# Altium schematic sheet Slave_Schematic_2.SchDoc
size A4; SheetNumber: 2; SheetTotal: 2
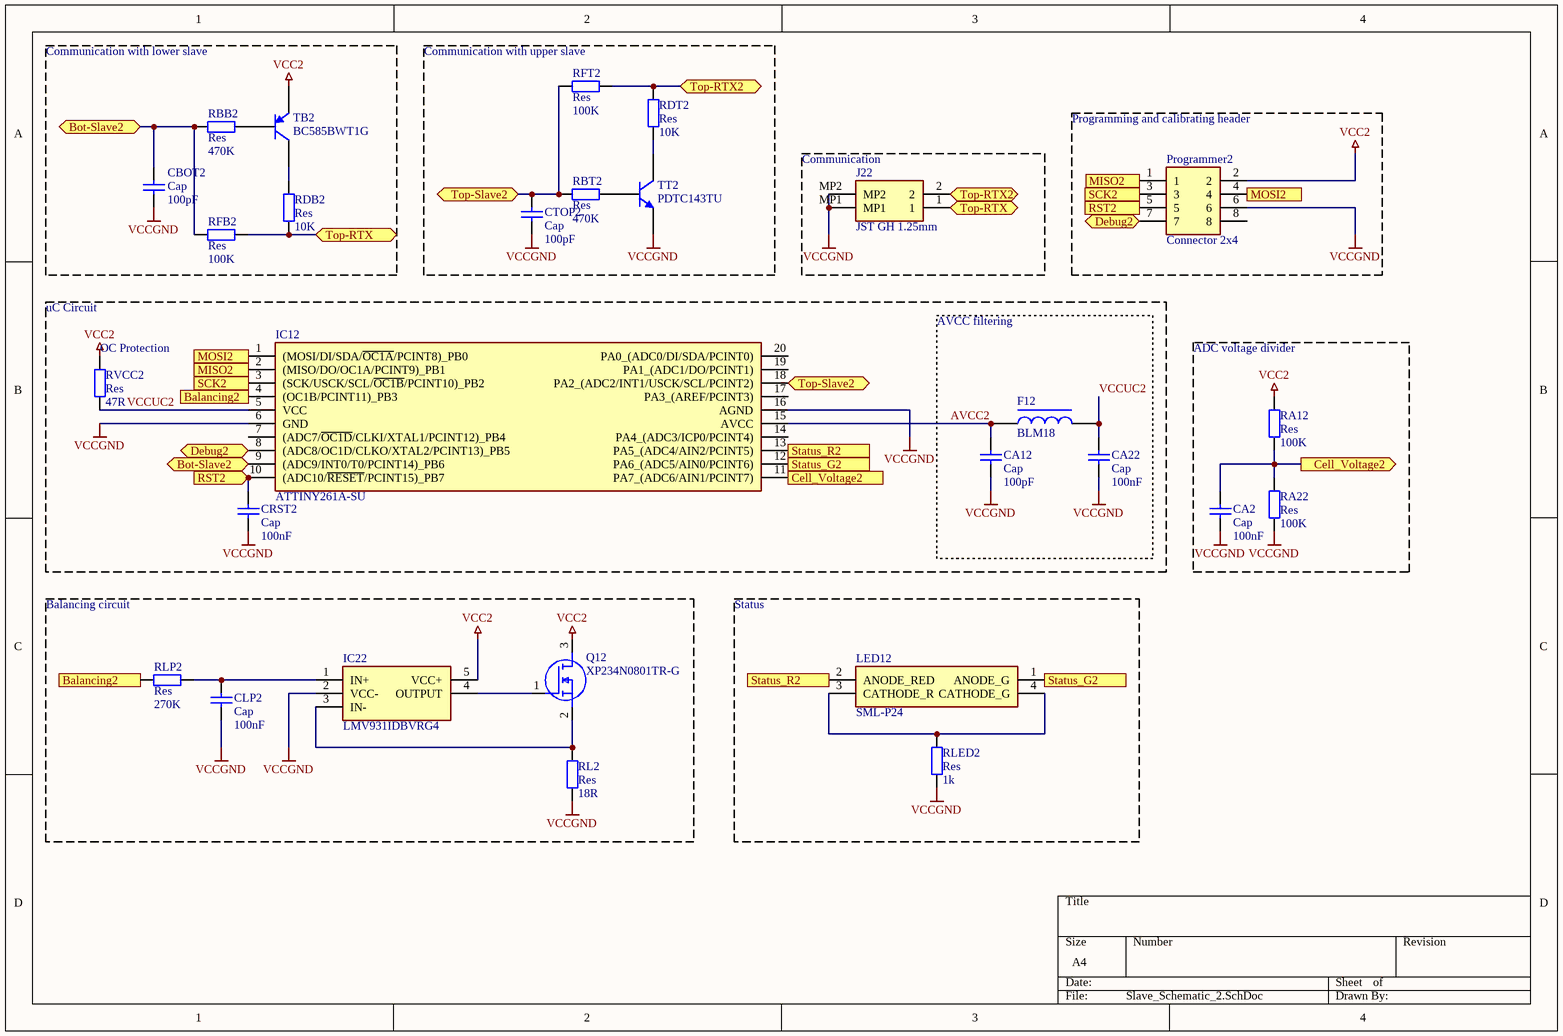
[diagram p0: Slave_Schematic_2.SchDoc]

## Parts
CA2  Cap  value 100nF  [0603]
CA12  Cap  value 100pF  [0603]
CA22  Cap  value 100nF  [0603]
CBOT2  Cap  value 100pF  [0603]
CLP2  Cap  value 100nF  [0603]
CRST2  Cap  value 100nF  [0603]
CTOP2  Cap  value 100pF  [0603]
F12  BLM18  [0603 - BLM18AG102BH1D]
IC12  ATTINY261A-SU  [TSSOP-20T (MO-153 AC)]
IC22  LMV931IDBVRG4  [TSSOP-5N]
J22  JST GH 1.25mm  [BM02BGHHDBTBTLFSN]
LED12  SML-P24  [1010 LED]
Programmer2  Connector 2x4  [Pads 2X4]
Q12  XP234N0801TR-G  [SOT-23 (TO-236)]
RA12  Res  value 100K  [0603]
RA22  Res  value 100K  [0603]
RBB2  Res  value 470K  [0603]
RBT2  Res  value 470K  [0603]
RDB2  Res  value 10K  [0603]
RDT2  Res  value 10K  [0603]
RFB2  Res  value 100K  [0603]
RFT2  Res  value 100K  [0603]
RL2  Res  value 18R  [1020 (Reversed)]
RLED2  Res  value 1k  [0603]
RLP2  Res  value 270K  [0603]
RVCC2  Res  value 47R  [0603]
TB2  BC585BWT1G  [SOT-323 (SC-70)]
TT2  PDTC143TU  [SOT-323 (SC-70)]

## Blocks framed on the sheet
Communication with lower slave: CBOT2 RBB2 RDB2 RFB2 TB2
Communication with upper slave: CTOP2 RBT2 RDT2 RFT2 TT2
Programming and calibrating header: Programmer2
Communication: J22
AVCC filtering: CA12 CA22 F12
ADC voltage divider: CA2 RA12 RA22
Balancing circuit: CLP2 IC22 Q12 RL2 RLP2
Status: LED12 RLED2

## Ports
Balancing2 (in), Balancing2 (out), Bot-Slave2 (bidir), Cell_Voltage2 (in), Cell_Voltage2 (out), Debug2 (bidir), MISO2 (in), MISO2 (out), MOSI2 (in), MOSI2 (out), RST2 (in), RST2 (out), SCK2 (in), SCK2 (out), Status_G2 (in), Status_G2 (out), Status_R2 (in), Status_R2 (out), Top-RTX2 (bidir), Top-RTX (bidir), Top-Slave2 (bidir)

## Nets
VCC2: IC22.5(VCC+) Programmer2.2 Q12.3(D) RA12.2 RVCC2.2 TB2.3(E)
VCCGND: CA2.1 CA12.1 CA22.1 CBOT2.1 CLP2.1 CRST2.1 CTOP2.1 IC12.6(GND) IC12.16(AGND) IC22.2(VCC-) J22.MP1 J22.MP2 Programmer2.6 RA22.1 RL2.1 RLED2.1 TT2.3(E)
AVCC2: CA12.2 F12.1 IC12.15(AVCC)
Balancing2: IC12.4((OC1B/PCINT11)_PB3) RLP2.1 ; port Balancing2
Bot-Slave2: CBOT2.2 IC12.9((ADC9/INT0/T0/PCINT14)_PB6) RBB2.1 RFB2.1 ; port Bot-Slave2
Cell_Voltage2: CA2.2 IC12.11(PA7_(ADC6/AIN1/PCINT7)) RA12.1 RA22.2 ; port Cell_Voltage2
Debug2: IC12.8((ADC8/OC1D/CLKO/XTAL2/PCINT13)_PB5) Programmer2.7 ; port Debug2
MISO2: IC12.2((MISO/DO/OC1A/PCINT9)_PB1) Programmer2.1 ; port MISO2
MOSI2: IC12.1((MOSI/DI/SDA/~{OC1A}/PCINT8)_PB0) Programmer2.4 ; port MOSI2
RST2: CRST2.2 IC12.10((ADC10/~{RESET}/PCINT15)_PB7) Programmer2.5 ; port RST2
SCK2: IC12.3((SCK/USCK/SCL/~{OC1B}/PCINT10)_PB2) Programmer2.3 ; port SCK2
Status_G2: IC12.12(PA6_(ADC5/AIN0/PCINT6)) LED12.1(ANODE_G) ; port Status_G2
Status_R2: IC12.13(PA5_(ADC4/AIN2/PCINT5)) LED12.2(ANODE_RED) ; port Status_R2
Top-RTX: J22.1 RDB2.1 RFB2.2 ; port Top-RTX
Top-RTX2: J22.2 RDT2.2 RFT2.2 ; port Top-RTX2
Top-Slave2: CTOP2.2 IC12.18(PA2_(ADC2/INT1/USCK/SCL/PCINT2)) RBT2.1 RFT2.1 ; port Top-Slave2
VCCUC2: CA22.2 F12.2 IC12.5(VCC) RVCC2.1
NetCLP2_2: CLP2.2 IC22.1(IN+) RLP2.2
NetIC22_3: IC22.3(IN-) Q12.2(S) RL2.2
NetIC22_4: IC22.4(OUTPUT) Q12.1(G)
NetLED12_3: LED12.3(CATHODE_R) LED12.4(CATHODE_G) RLED2.2
NetRBB2_2: RBB2.2 TB2.2(B)
NetRBT2_2: RBT2.2 TT2.2(B)
NetRDB2_2: RDB2.2 TB2.1(C)
NetRDT2_1: RDT2.1 TT2.1(C)

Not connected (* = marked no-connect by the designer): IC12 7((ADC7/~{OC1D}/CLKI/XTAL1/PCINT12)_PB4) 14(PA4_(ADC3/ICP0/PCINT4)) 17(PA3_(AREF/PCINT3)) 19(PA1_(ADC1/DO/PCINT1)) 20(PA0_(ADC0/DI/SDA/PCINT0)); Programmer2 8

## Notes on the sheet
- uC Circuit
- (near RVCC2) OC Protection

## Library data of the parts
CA2 CA12 CA22 CBOT2 CLP2 CRST2 CTOP2 = Cap: Capacitor; Published: 8-Jun-2000; LatestRevisionDate: 17-Jul-2002; LatestRevisionNote: Re-released for DXP Platform.; PackageReference: RAD-0.3; Publisher: Altium Limited; PackageDescription: Radial Cap, Thru-Hole; 2 Leads; 0.3 in Pin Spacing
F12 = BLM18: Filter
IC12 = ATTINY261A-SU: Integrated Circuit; Manufacturer_Name: Microchip; Datasheet Link: http://www.atmel.com/Images/doc8197.pdf; Height: 2.65mm; Manufacturer_Part_Number: ATTINY261A-SU; Mouser Part Number: 556-ATTINY261A-SU; Mouser Price/Stock: https://www.mouser.co.uk/ProductDetail/Microchip-Technology-Atmel/ATTINY261A-SU?qs=LHmEVA8xxfYkt4Dy%2F2AOtw%3D%3D; Arrow Part Number: ATTINY261A-SU; Arrow Price/Stock: https://www.arrow.com/en/products/attiny261a-su/microchip-technology
IC22 = LMV931IDBVRG4: Integrated Circuit; Manufacturer_Name: Texas Instruments; Datasheet Link: http://uk.rs-online.com/web/p/products/6609669; Height: 1.45mm; Manufacturer_Part_Number: LMV931IDBVRG4
J22 = BM02B-GHHD-B-TBT_LF__SN_: JST GH 1.25 2pin; Manufacturer_Name: JST (JAPAN SOLDERLESS TERMINALS); Manufacturer_Part_Number: BM02B-GHHD-B-TBT(LF)(SN); Height: 4.05mm
LED12 = SML-P24: Dual Color LED; Manufacturer_Name: ROHM Semiconductor; Manufacturer_Part_Number: SML-P24MUWT86R; Datasheet Link: https://www.rohm.com/datasheet/SML-P24MUW(R)/sml-p24muw-e; Height: 0.25mm; Mouser Part Number: 755-SML-P24MUWT86R; Mouser Price/Stock: https://www.mouser.co.uk/ProductDetail/ROHM-Semiconductor/SML-P24MUWT86R?qs=SP2aZMzhwxgr8eZ6SbTI9w%3D%3D
Programmer2 = Connector 2x4: Connector 1,27mm; Manufacturer_Name: Mill-Max; Manufacturer_Part_Number: 855-22-008-10-001101; Datasheet Link: https://componentsearchengine.com/Datasheets/2/855-22-008-10-001101.pdf; Height: 6.27mm; Mouser Part Number: 575-855-22-008-10; Mouser Price/Stock: https://www.mouser.co.uk/ProductDetail/Mill-Max/855-22-008-10-001101?qs=mPCt1EmoOdQMosTdRU7w4Q%3D%3D
Q12 = XP234N0801TR-G: MOSFET (N-Channel); Manufacturer_Name: Torex; Datasheet Link: https://4donline.ihs.com/images/VipMasterIC/IC/TOSL/TOSL-S-A0008892481/TOSL-S-A0008892481-1.pdf?hkey=CECEF36DEECDED6468708AAF2E19C0C6; Height: 1.15mm; Manufacturer_Part_Number: XP234N0801TR-G; Mouser Part Number: 865-XP234N0801TR-G; Mouser Price/Stock: https://www.mouser.co.uk/ProductDetail/Torex-Semiconductor/XP234N0801TR-G?qs=BJlw7L4Cy7%252BWe%2FbHvnXcKQ%3D%3D
RA12 RA22 RBB2 RBT2 RDB2 RDT2 RFB2 RFT2 RL2 RLED2 RLP2 RVCC2 = Res: Resistor; Published: 8-Jun-2000; LatestRevisionDate: 17-Jul-2002; LatestRevisionNote: Re-released for DXP Platform.; PackageReference: AXIAL-0.4; Publisher: Altium Limited; PackageDescription: Axial Device, Thru-Hole; 2 Leads; 0.4 in Pin Spacing
TB2 = BC585BWT1G: PNP; Published: 8-Jun-2000; LatestRevisionDate: 29-May-2009; LatestRevisionNote: IPC-7351 Footprint Added.; PackageVersion: Aug-1999; PackageReference: SOT-23B; Publisher: Altium Limited; PackageDescription: 3-Pin SOT-23 Package 0.95 mm Pitch, 2.4 mm Lead Span
TT2 = PDTC143TU: NPN; Published: 8-Jun-2000; LatestRevisionDate: 17-Jul-2002; LatestRevisionNote: Re-released for DXP Platform.; PackageReference: TO-226-AA; Publisher: Altium Limited; PackageDescription: TO, Flat Index; 3 In-Line, Axial Leads; Body Dia. 4.8mm; Leads 0.55 x 0.51 mm (max); Code_JEDEC: TO-226-AA